# Altium schematic sheet Interface.SchDoc
size A; SheetNumber: 2; SheetTotal: 4
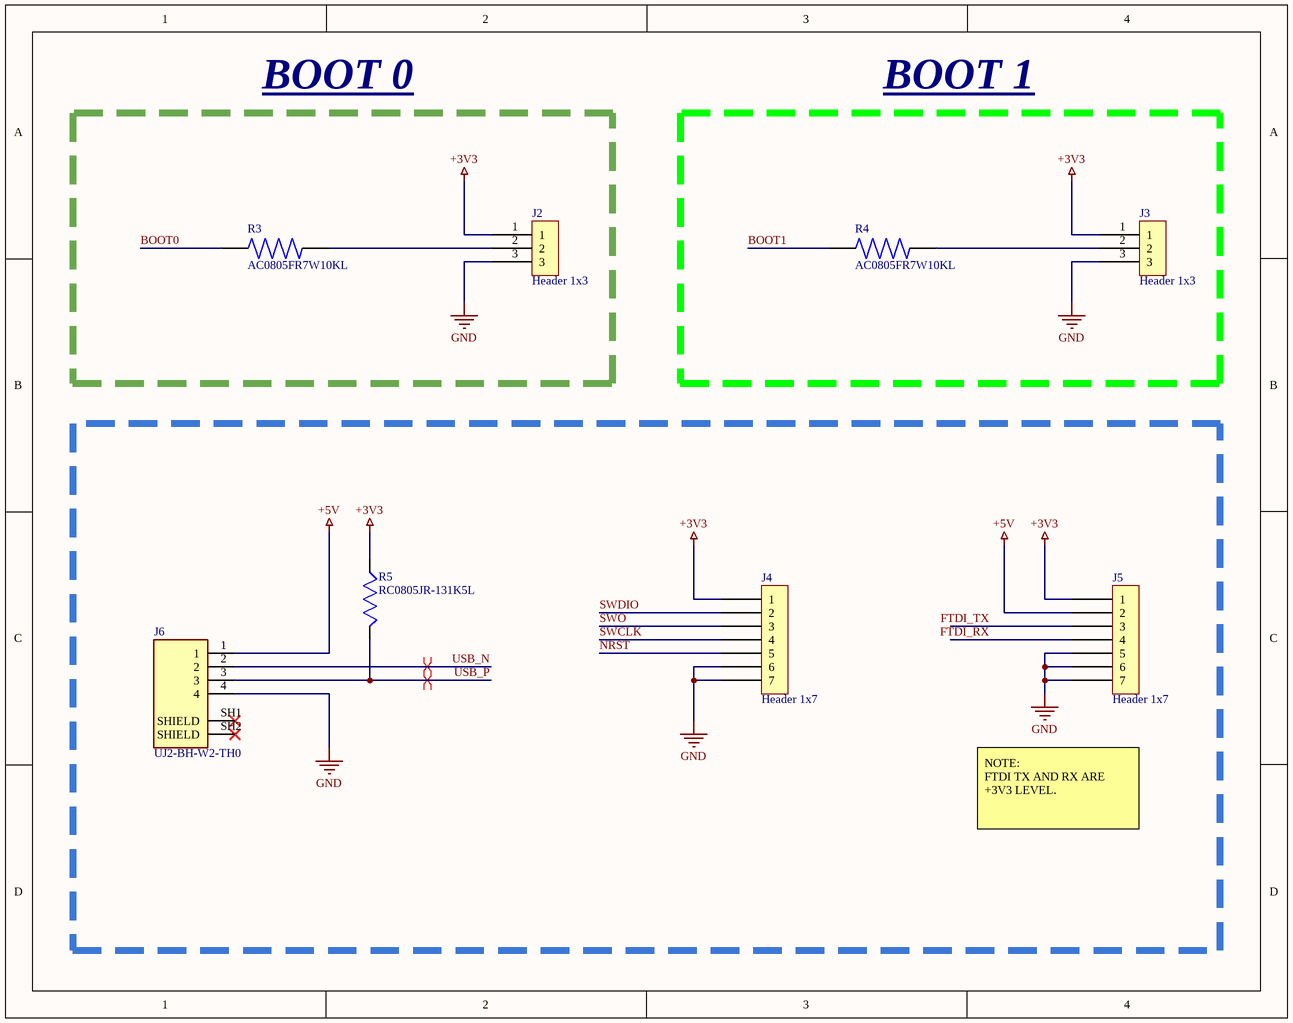
[diagram p0: Interface.SchDoc]

## Parts
J2  Header 1x3  [Header 1x3 male]
J3  Header 1x3  [Header 1x3 male]
J4  Header 1x7  [Header 1x7 male]
J5  Header 1x7  [Header 1x7 male]
J6  UJ2-BH-W2-TH0  [UJ2-BH-W2-TH0]
R3  AC0805FR7W10KL  [RESC2012X60N]
R4  AC0805FR7W10KL  [RESC2012X60N]
R5  RC0805JR-131K5L  [RESC2012X60N]

## Blocks framed on the sheet
BOOT 0: J2 R3
BOOT 1: J3 R4

## Nets
+3V3: J2.1 J3.1 J4.1 J5.1 R5.2
+5V: J5.2 J6.1
GND: J2.3 J3.3 J4.6 J4.7 J5.5 J5.6 J5.7 J6.4
BOOT0: R3.1
BOOT1: R4.1
FTDI_RX: J5.4
FTDI_TX: J5.3
NRST: J4.5
SWCLK: J4.4
SWDIO: J4.2
SWO: J4.3
USB_N: J6.2
USB_P: J6.3 R5.1
NetJ2_2: J2.2 R3.2
NetJ3_2: J3.2 R4.2

Not connected (* = marked no-connect by the designer): J6 SH1(SHIELD)* SH2(SHIELD)*

## Layout directives
differential pair; differential pair class USB: USB_N, USB_P

## Notes on the sheet
- NOTE:
  FTDI TX AND RX ARE +3V3 LEVEL.

## Library data of the parts
J6 = UJ2-BH-W2-TH0: 6 Âµin Plating Thickness, White Insulator, USB Receptacle; MF: {'manufacturer': u'CUI Devices'}; Package: None; Price: None; Value: *; MP: UJ2-BH-W2-TH; Availability: Unavailable
R3 R4 = AC0805FR7W10KL: RES SMD 18 OHM 5% 1/8W 0805; MF: {'manufacturer': u'Yageo Corporation'}; Package: None; Price: None; Value: *; MP: AC0805FR7W10KL; Availability: Unavailable
R5 = RC0805JR-131K5L: MF: {'manufacturer': u'Yageo'}; Package: None; Price: None; Value: *; MP: RC0805JR-131K5L; Availability: Unavailable